# EAGLE design Sediment Board (EAGLE 7.6.0)

## Sheet 1 of 2
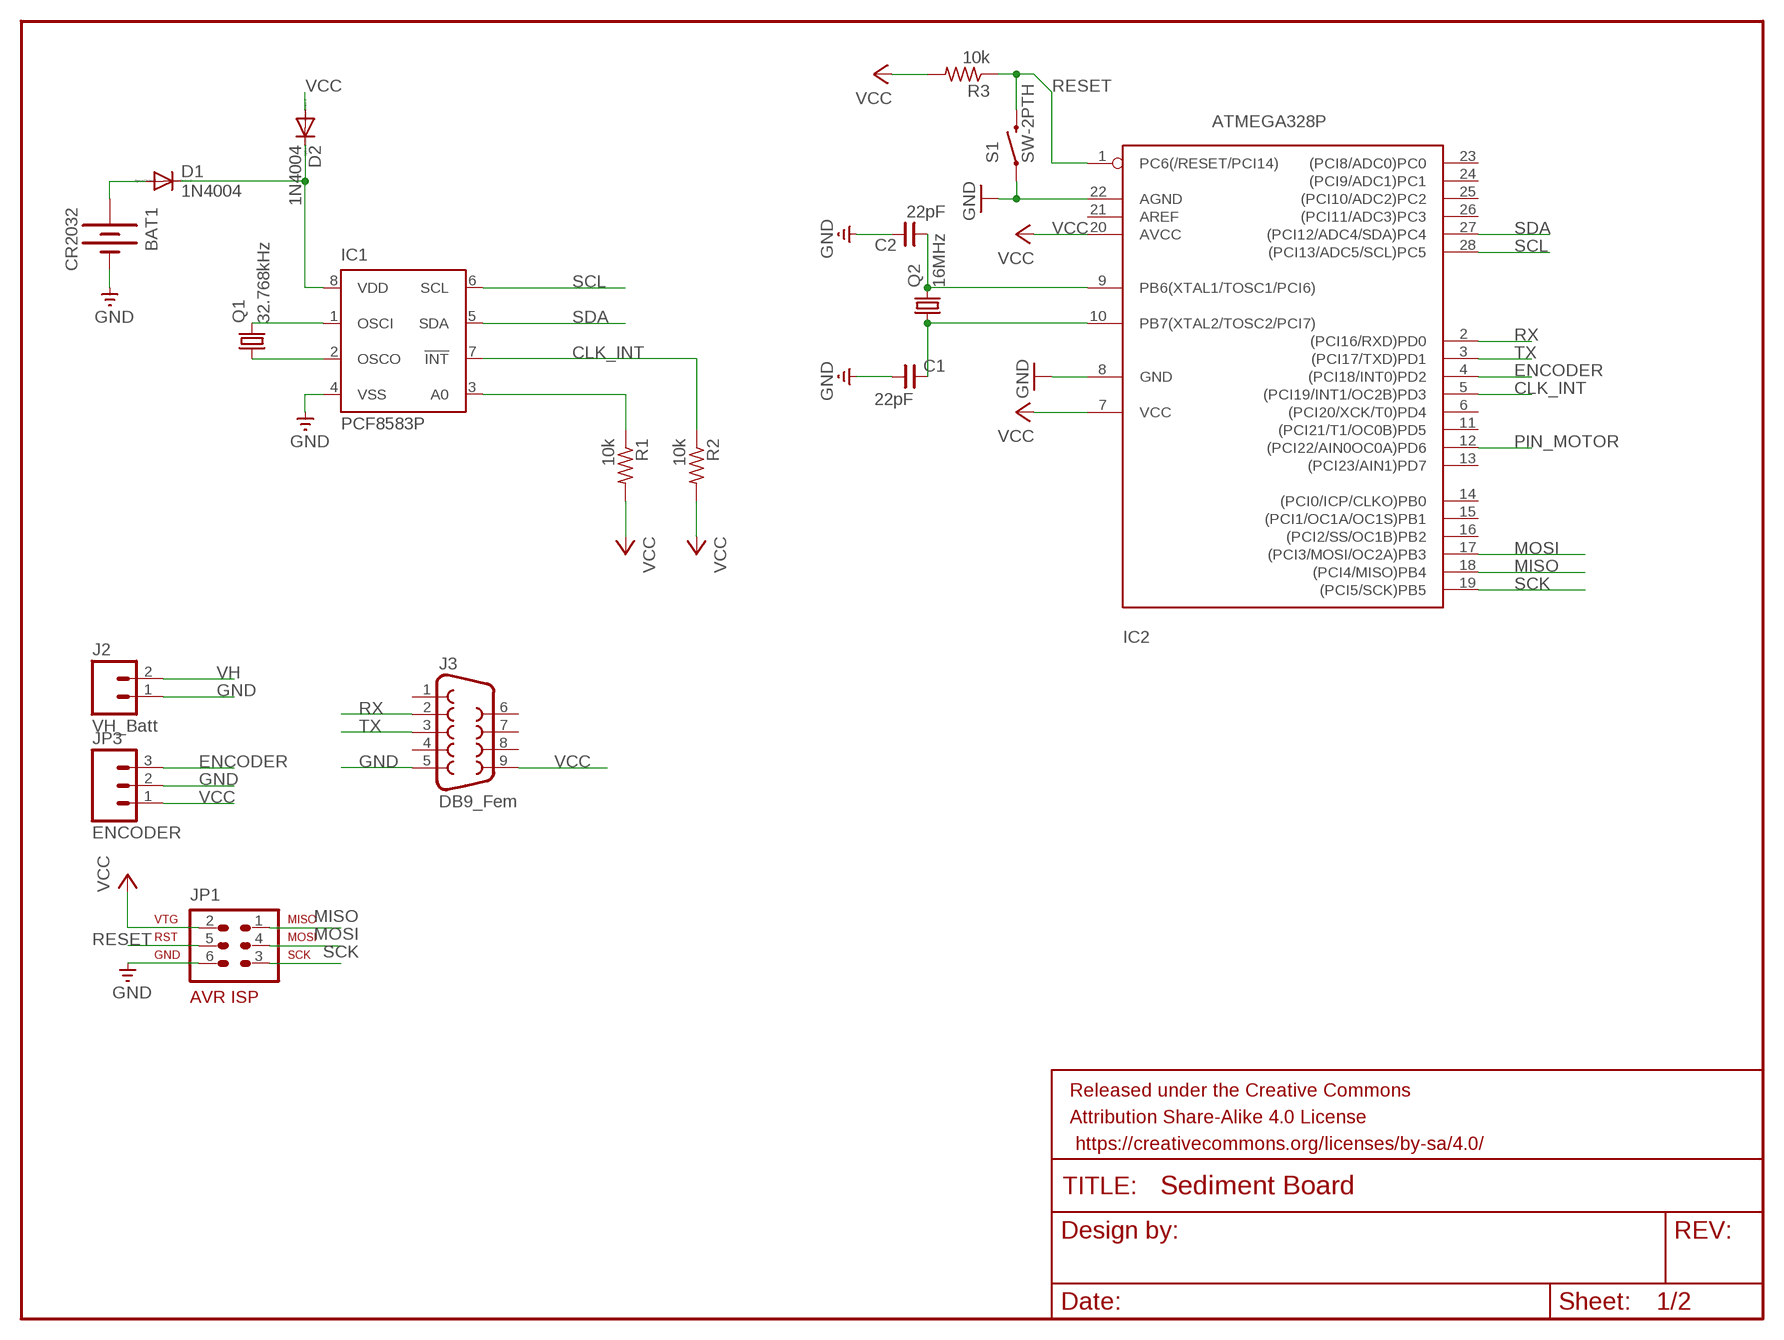
[diagram p0: schematic, sheet 1]

### Parts
BAT1  CR2032  BATTERY20PTH  [BATTCOM_20MM_PTH]
C1  22pF  CNP-C025-050X025  [C025-050X025]
C2  22pF  CNP-C025-050X025  [C025-050X025]
D1  1N4004  [DO41-10]
D2  1N4004  [DO41-10]
FRAME1  FRAME-LETTER  [CREATIVE_COMMONS]
IC1  PCF8583P  [DIL08]
IC2  ATMEGA328P  ATMEGA328PROUND  [DIL28-3-ROUND]
J2  VH_Batt  M023.5MM  [SCREWTERMINAL-3.5MM-2]
J3  DB9_Fem  DB9FEMALE  [DB9]
JP1  AVR-ISP-6  [AVR-ISP-6]
JP3  ENCODER  M03POLAR  [MOLEX-1X3]
Q1  32.768kHz  CRYSTALTC26H  [TC26H]
Q2  16MHz  CRYSTALHC49U70  [HC49U70]
R1  10k  R-US_0207/10  [0207/10]
R2  10k  R-US_0207/10  [0207/10]
R3  10k  R-US_0207/10  [0207/10]
S1  SW-2PTH  SWITCH-MOMENTARY-2PTH  [TACTILE-PTH]

### Nets
CLK_INT: IC1.7(!INT) IC2.5((PCI19/INT1/OC2B)PD3) R2.1
ENCODER: IC2.4((PCI18/INT0)PD2) JP3.3
GND: BAT1.2(-) C1.1 C2.2 IC1.4(VSS) IC2.8(GND) IC2.22(AGND) J2.1 J3.5 JP1.6 JP3.2 S1.1 ; also sheet 2
MISO: IC2.18((PCI4/MISO)PB4) JP1.1
MOSI: IC2.17((PCI3/MOSI/OC2A)PB3) JP1.4
N$1: D1.C D2.C IC1.8(VDD)
N$2: IC1.1(OSCI) Q1.2
N$3: IC1.2(OSCO) Q1.1
N$5: BAT1.1(+) D1.A
N$6: IC1.3(A0) R1.1
N$7: C2.1 IC2.9(PB6(XTAL1/TOSC1/PCI6)) Q2.2
N$8: C1.2 IC2.10(PB7(XTAL2/TOSC2/PCI7)) Q2.1
PIN_MOTOR: IC2.12((PCI22/AIN0OC0A)PD6) ; also sheet 2
RESET: IC2.1(PC6(/RESET/PCI14)) JP1.5 R3.1 S1.3
RX: IC2.2((PCI16/RXD)PD0) J3.2
SCK: IC2.19((PCI5/SCK)PB5) JP1.3
SCL: IC1.6(SCL) IC2.28((PCI13/ADC5/SCL)PC5)
SDA: IC1.5(SDA) IC2.27((PCI12/ADC4/SDA)PC4)
TX: IC2.3((PCI17/TXD)PD1) J3.3
VCC: D2.A IC2.7(VCC) IC2.20(AVCC) J3.9 JP1.2 JP3.1 R1.2 R2.2 R3.2 ; also sheet 2
VH: J2.2 ; also sheet 2
Unconnected: IC2.6((PCI20/XCK/T0)PD4) IC2.11((PCI21/T1/OC0B)PD5) IC2.13((PCI23/AIN1)PD7) IC2.14((PCI0/ICP/CLKO)PB0) IC2.15((PCI1/OC1A/OC1S)PB1) IC2.16((PCI2/SS/OC1B)PB2) IC2.21(AREF) IC2.23((PCI8/ADC0)PC0) IC2.24((PCI9/ADC1)PC1) IC2.25((PCI10/ADC2)PC2) IC2.26((PCI11/ADC3)PC3) J3.1 J3.4 J3.6 J3.7 J3.8

## Sheet 2 of 2
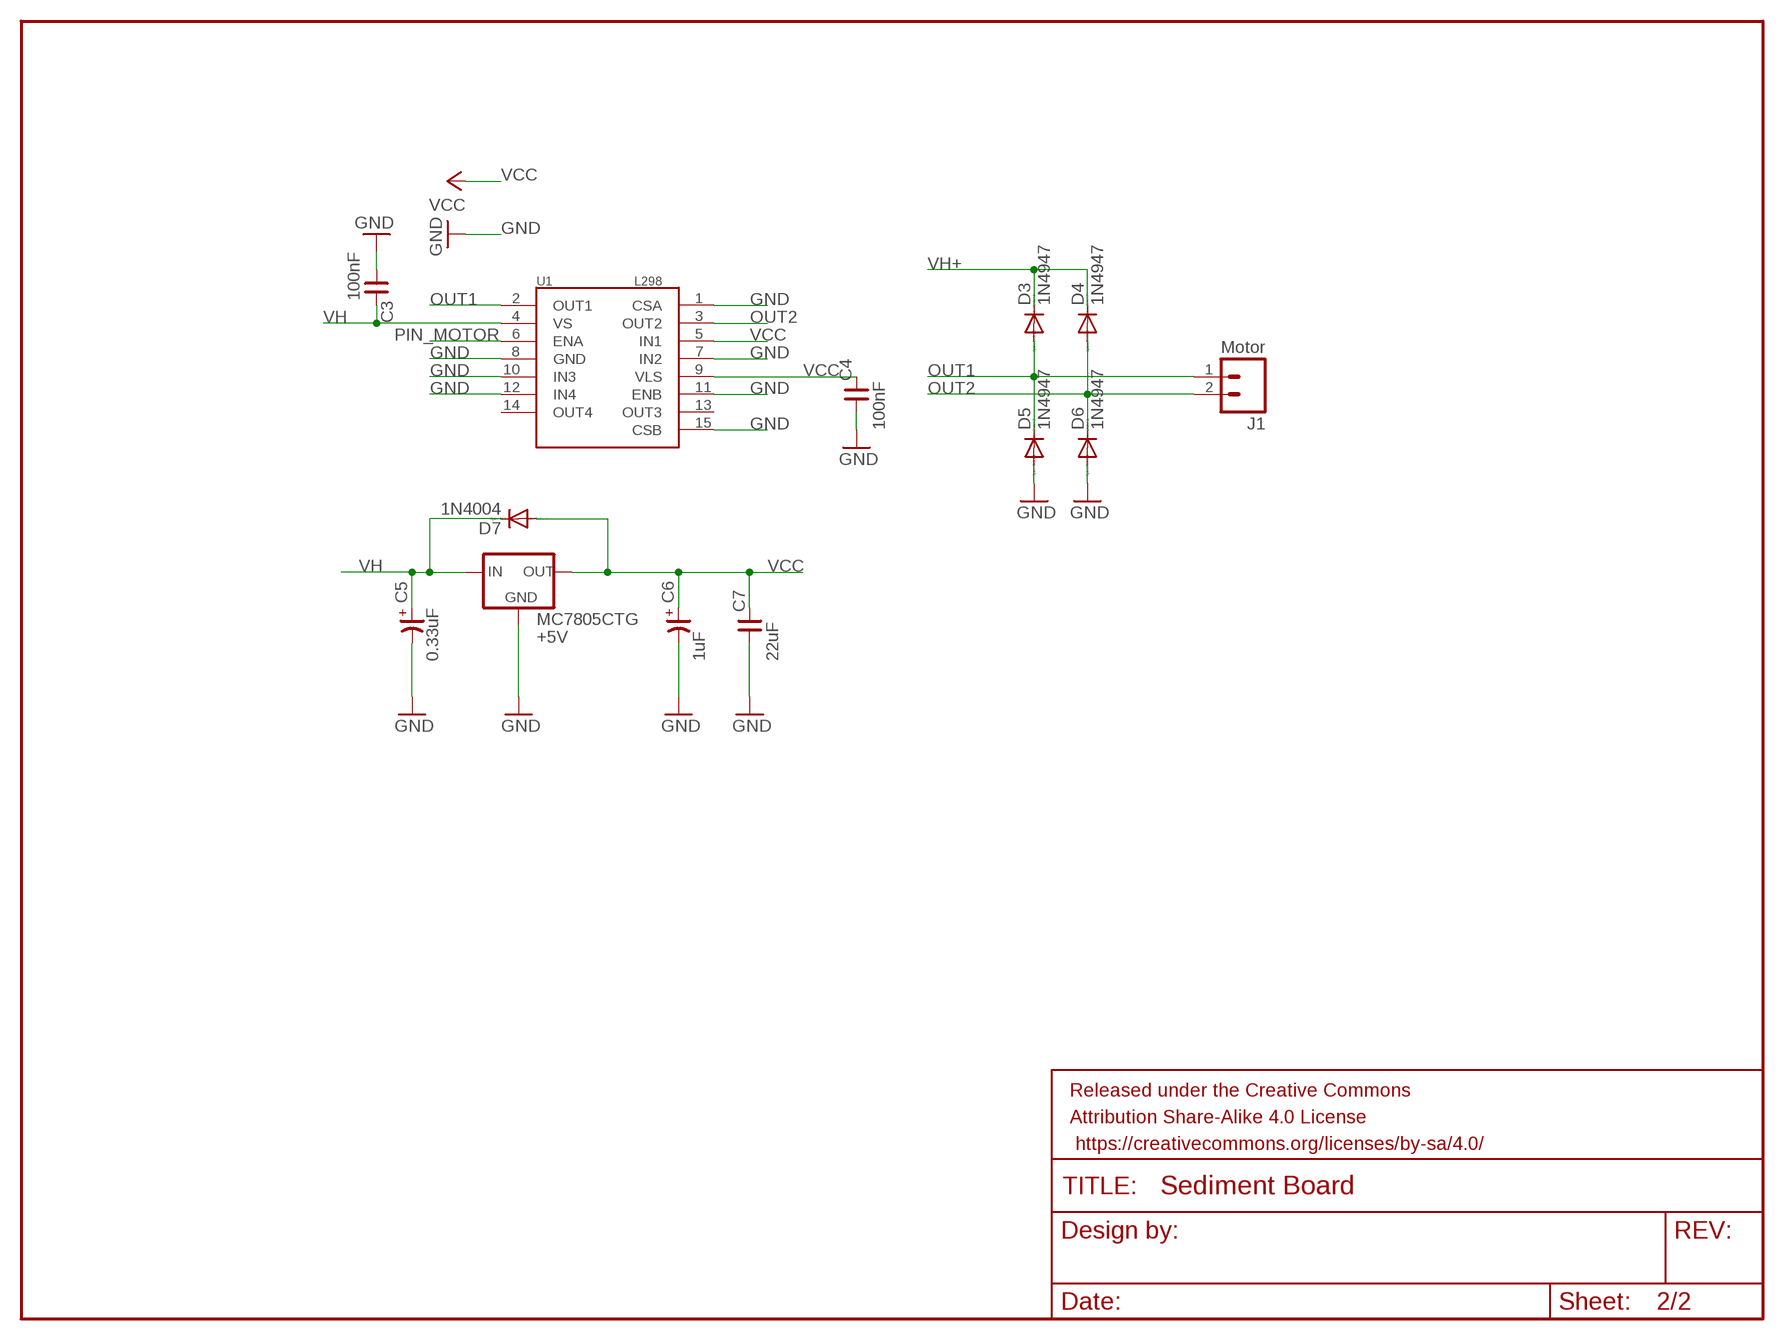
[diagram p1: schematic, sheet 2]

### Parts
C3  100nF  CNP-C025-050X025  [C025-050X025]
C4  100nF  CNP-C025-050X025  [C025-050X025]
C5  0.33uF  CP-TT025-040  [TT-025-040]
C6  1uF  CP-TT025-040  [TT-025-040]
C7  22uF  CNP-C025-050X025  [C025-050X025]
D3  1N4947  1N4942  [DO41-10]
D4  1N4947  1N4942  [DO41-10]
D5  1N4947  1N4942  [DO41-10]
D6  1N4947  1N4942  [DO41-10]
D7  1N4004  [DO41-10]
FRAME2  FRAME-LETTER  [CREATIVE_COMMONS]
J1  Motor  M023.5MM  [SCREWTERMINAL-3.5MM-2]
MC7805CTG  +5V  V_REG_78XXSIDE  [78XXL]
U1  L298  [MULTIWATT15]

### Nets
GND: C3.1 C4.1 C5.- C6.- C7.1 D5.A D6.A MC7805CTG.GND U1.1(CSA) U1.7(IN2) U1.8(GND) U1.10(IN3) U1.11(ENB) U1.12(IN4) U1.15(CSB) ; also sheet 1
OUT1: D3.A D5.C J1.1 U1.2(OUT1)
OUT2: D4.A D6.C J1.2 U1.3(OUT2)
PIN_MOTOR: U1.6(ENA) ; also sheet 1
VCC: C4.2 C6.+ C7.2 D7.A MC7805CTG.OUT U1.5(IN1) U1.9(VLS) ; also sheet 1
VH: C3.2 C5.+ D7.C MC7805CTG.IN U1.4(VS) ; also sheet 1
VH+: D3.C D4.C
Unconnected: U1.13(OUT3) U1.14(OUT4)

## Library data of the parts
BAT1 = SparkFun:BATTERY: Battery Holders Various common sizes : AA, AAA, 20mm coin cell and 12mm coin cell.
C1-C4 C7 = cap-master:CNP-: NON-POLARIZED CAP
C5 C6 = cap-master:CP-: POLARIZED CAP
D1 D2 D7 = diode:1N4004: DIODE general purpose rectifier, 1 A
D3-D6 = diode:1N4942: DIODE 1.0 A, 200 V, 150 ns
FRAME1 FRAME2 = SparkFun-Aesthetics:FRAME-LETTER: Schematic Frame Standard 8.5x11 US Letter frame
IC1 = ds1307_pcf8583:PCF8583: I2C-Bus CLOCK/CALENDAR
IC2 = atmega328:ATMEGA328*P: MICROCONTROLLER 32 kBytes FLASH 2 kBytes SRAM 1 kBytes EEPROM USART 8-channel 10 bit ADC
J1 J2 = SparkFun-Connectors:M02: Standard 2-pin 0.1" header. Use with - straight break away headers ( PRT-00116) - right angle break away headers (PRT-00553) - swiss pins (PRT-00743) - machine pins (PRT-00117) - female headers (PRT-00115) Molex polarized connector foot print use with: PRT-08233 with associated crimp pins and housings. 2.54_SCREWTERM for use with PRT-10571. 3.5mm Screw Terminal footprints for PRT-08084 5mm Screw Terminal footprints for use with PRT-08432; PROD_ID: CONN-08399
J3 = SparkFun-Connectors:DB9: DB9 Connector Standard DB9 (D-Sub 9) serial connector. Can be used for CAN bus as well as RS485 and RS232. Footprint production proven. Spark Fun Electronics SKU : PRT-00429; PROD_ID: CONN-08194
JP1 = atmel-1:AVR-ISP-6: AVR ISP-6 Serial Programming Header
JP3 = SparkFun:M03: Header 3 Standard 3-pin 0.1" header. Use with straight break away headers (SKU : PRT-00116), right angle break away headers (PRT-00553), swiss pins (PRT-00743), machine pins (PRT-00117), and female headers (PRT-00115). Molex polarized connector foot print use with SKU : PRT-08232 with associated crimp pins and housings.
MC7805CTG = SparkFun:V_REG_78XX: Voltage Regulator Standard 7805 5V regulator. IGO (Input Ground Output). Spark Fun Electronics SKU : COM-00107
Q1 Q2 = crystal:CRYSTAL: CRYSTAL; OC_FARNELL: unknown; OC_NEWARK: unknown
R1-R3 = resistor:R-US_: RESISTOR, American symbol
S1 = SparkFun:SWITCH-MOMENTARY-2
U1 = SparkFun:L298: L298 Dual Full Bridge Driver

## Net classes
0 default: clearance 0.205 mm

## Board
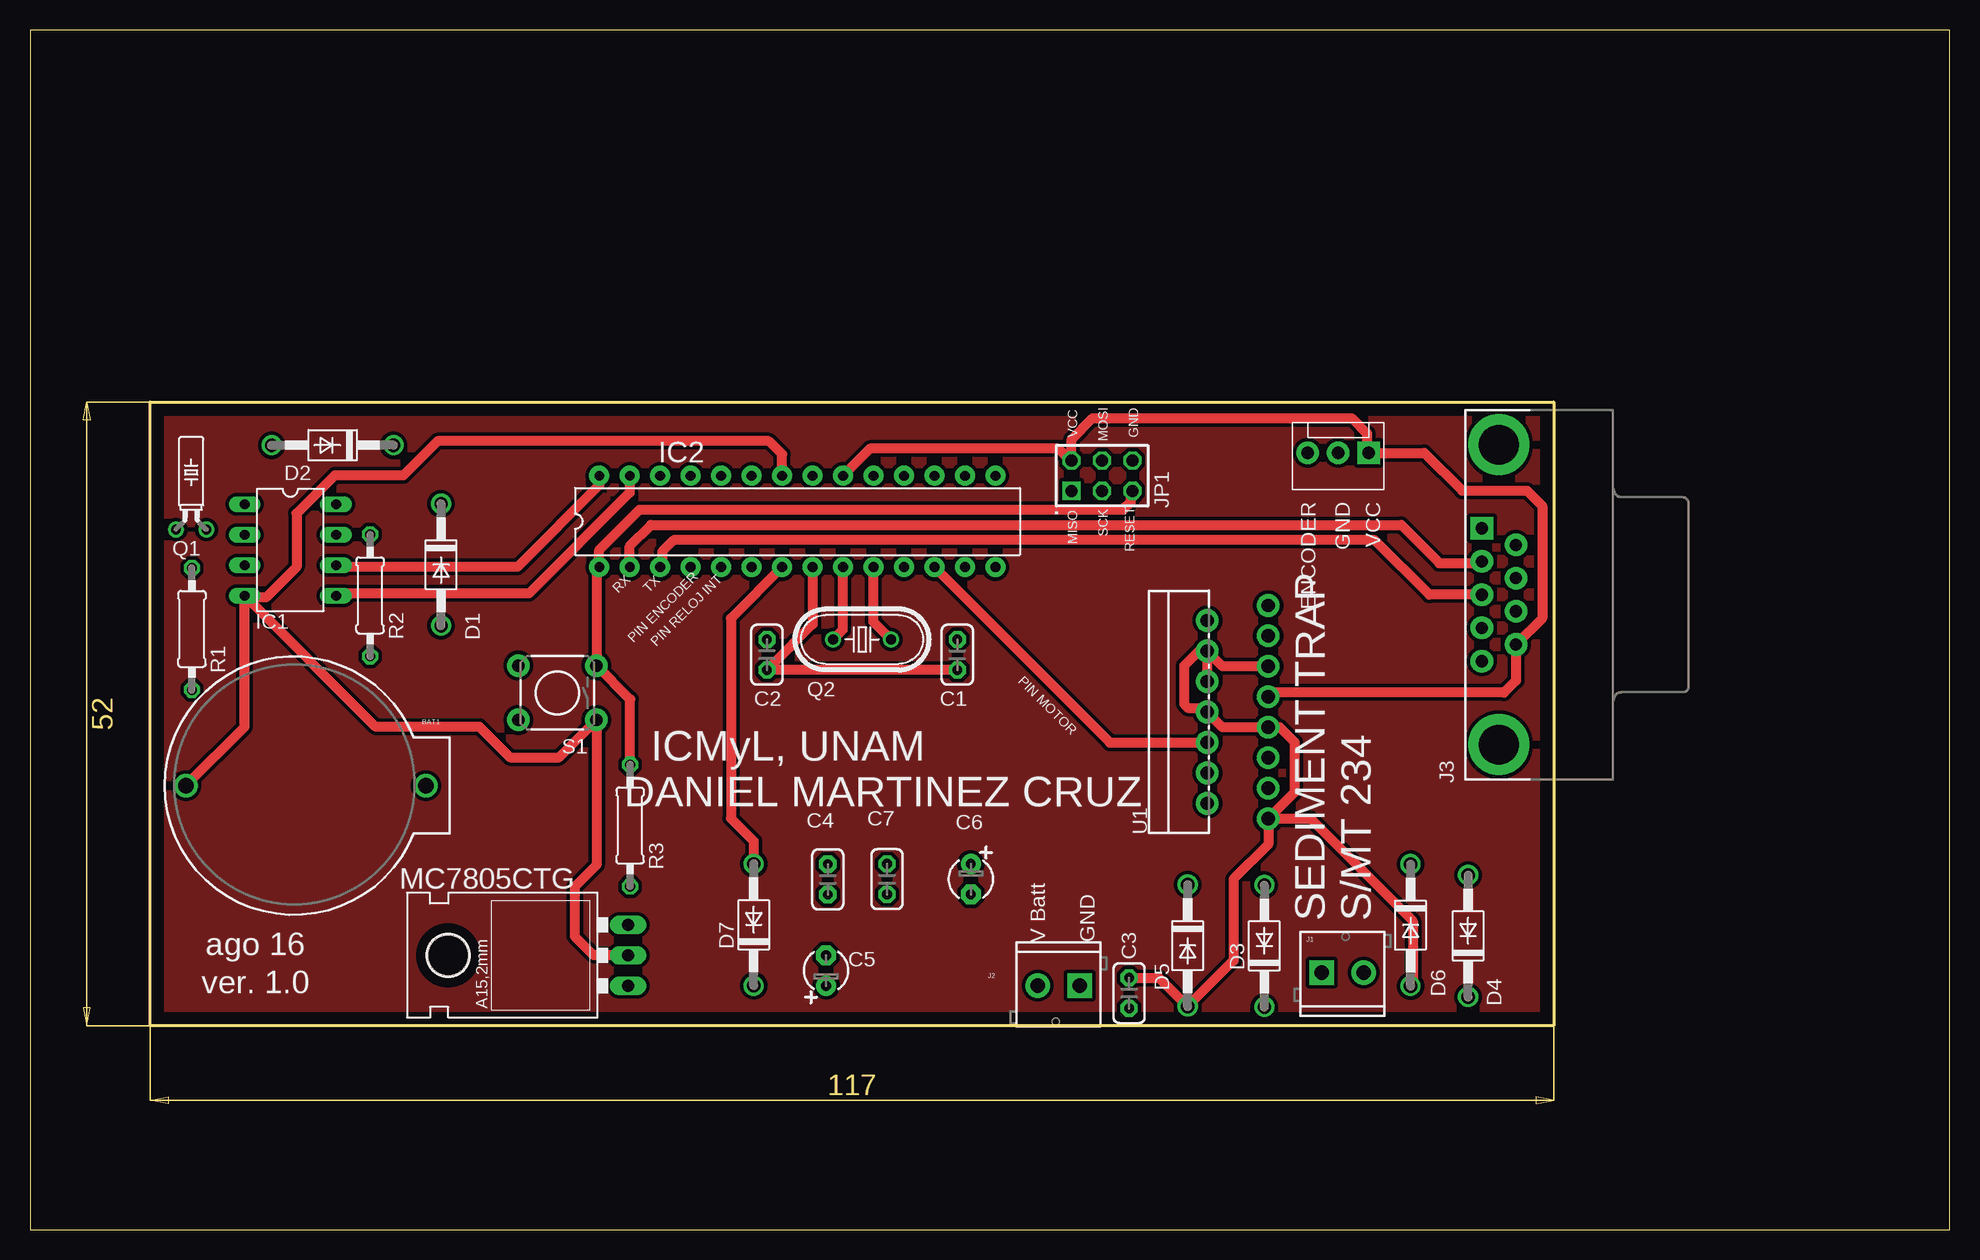
[diagram p2: board, top side]
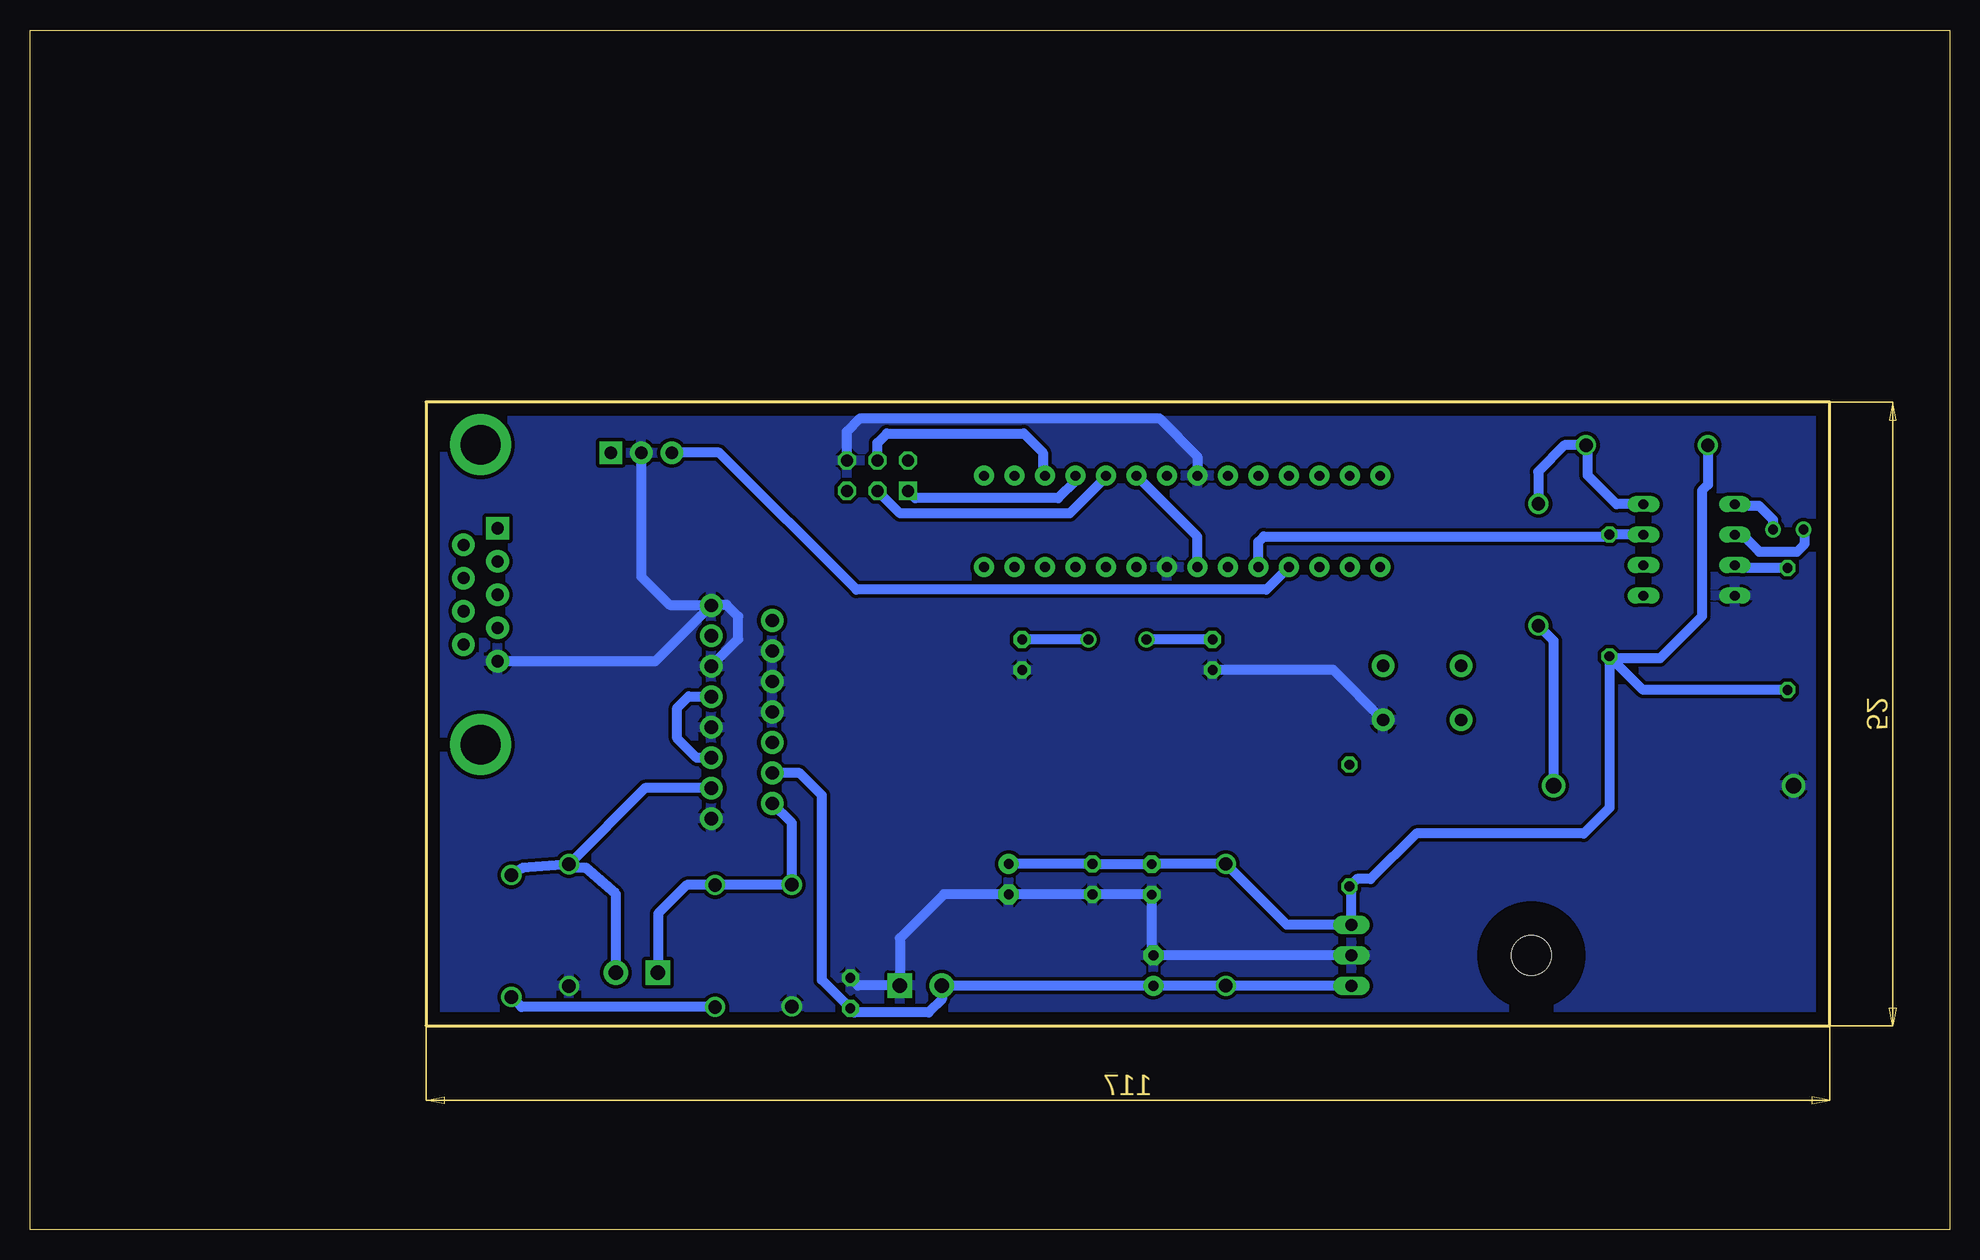
[diagram p3: board, bottom side, seen from below]

Size 160 x 100 mm. Coordinates in mm from the lower left corner, seen from the top.
Outline: 0,0 160,0 160,100 0,100 0,0
Outline: 10,69 127,69 127,17 10,17 10,69
Copper layers (1*16): Top 0.035mm / dielectric 1.5mm / Bottom 0.035mm
Design rules "default": minimum track width 10mil, minimum drill 24mil, track to track 8mil, track to pad 8mil, pad to pad 8mil, via to via 8mil, smd to smd 8mil, copper to edge 40mil, drill to drill 8mil, minimum pad ring 10mil, minimum via ring 8mil, stop-mask expansion 4mil, vias tented up to drill 0mil, thermal gap 10mil

### Footprints (pad centres in the part's own frame; a part is rotated, then mirrored left to right if it is on the bottom)
BATTCOM_20MM_PTH = drill 1.3: 1 20,0; 2 0,0
C025-050X025 = drill 0.813 pad 1.422 octagon: 1 -1.27,0; 2 1.27,0
TT-025-040 = drill 0.813 pad 1.676: + -1.27,0 | drill 0.813 pad 1.676 octagon: - 1.27,0
DO41-10 = drill 1.118: A 5.08,0; C -5.08,0
DIL08 = drill 0.813 long: 1 -3.81,-3.81; 2 -1.27,-3.81; 3 1.27,-3.81; 4 3.81,-3.81; 5 3.81,3.81; 6 1.27,3.81; 7 -1.27,3.81; 8 -3.81,3.81
DIL28-3-ROUND = drill 0.813 pad 1.676: 1 -16.51,-3.81; 2 -13.97,-3.81; 3 -11.43,-3.81; 4 -8.89,-3.81; 5 -6.35,-3.81; 6 -3.81,-3.81; 7 -1.27,-3.81; 8 1.27,-3.81; 9 3.81,-3.81; 10 6.35,-3.81; 11 8.89,-3.81; 12 11.43,-3.81; 13 13.97,-3.81; 14 16.51,-3.81; 15 16.51,3.81; 16 13.97,3.81; 17 11.43,3.81; 18 8.89,3.81; 19 6.35,3.81; 20 3.81,3.81; 21 1.27,3.81; 22 -1.27,3.81; 23 -3.81,3.81; 24 -6.35,3.81; 25 -8.89,3.81; 26 -11.43,3.81; 27 -13.97,3.81; 28 -16.51,3.81
SCREWTERMINAL-3.5MM-2 = drill 1.2 pad 2.032 square: 1 0,0 | drill 1.2 pad 2.032: 2 3.5,0
DB9 = drill 1.016 pad 1.88 square: 1 -5.54,-1.42 | drill 1.016 pad 1.88: 2 -2.77,-1.42; 3 0,-1.42; 4 2.77,-1.42; 5 5.54,-1.42; 6 -4.15,1.42; 7 -1.38,1.42; 8 1.38,1.42; 9 4.15,1.42 | drill 3.302 pad 5.08: G1 -12.5,0; G2 12.5,0
AVR-ISP-6 = drill 1.016 square: 1 -2.54,-1.27 | drill 1.016 octagon: 2 -2.54,1.27; 3 0,-1.27; 4 0,1.27; 5 2.54,-1.27; 6 2.54,1.27
MOLEX-1X3 = drill 1.016 pad 1.88 square: 1 0,0 | drill 1.016 pad 1.88: 2 2.54,0; 3 5.08,0
78XXL = drill 1.016 long: GND 0,-3.81; IN -2.54,-3.81; OUT 2.54,-3.81 | hole 3.302: 0,11.176
TC26H = drill 0.813: 1 -1.27,0; 2 1.27,0
HC49U70 = drill 0.813: 1 -2.413,0; 2 2.413,0
0207/10 = drill 0.813 octagon: 1 -5.08,0; 2 5.08,0
TACTILE-PTH = drill 1.016 pad 1.88: 1 -3.251,2.261; 2 3.251,2.261; 3 -3.251,-2.261; 4 3.251,-2.261
MULTIWATT15 = drill 1.1 pad 1.9: 1 -8.95,-2.39; 2 -7.68,2.69; 3 -6.41,-2.39; 4 -5.14,2.69; 5 -3.87,-2.39; 6 -2.6,2.69; 7 -1.33,-2.39; 8 -0.06,2.69; 9 1.21,-2.39; 10 2.48,2.69; 11 3.75,-2.39; 12 5.02,2.69; 13 6.29,-2.39; 14 7.56,2.69; 15 8.83,-2.39

### Placement (x,y rotation side)
BAT1  12.99,37.01 0 top
C1  77.3,47.92 90 top
C2  61.42,47.92 270 top
C3  91.61,19.71 270 top
C4  66.5,29.19 90 top
C5  66.36,21.59 90 top
C6  78.42,29.21 270 top
C7  71.44,29.21 90 top
D1  34.27,55.42 270 top
D2  25.23,65.38 180 top
D3  102.89,23.64 90 top
D4  119.87,24.47 90 top
D5  96.5,23.67 270 top
D6  115.08,25.38 270 top
D7  60.33,25.4 90 top
FRAME1  54.51,1.76 0 top
FRAME2  54.51,1.76 0 top
IC1  21.7,56.65 270 top
IC2  63.96,59.03 0 top
J1  107.66,21.41 0 top
J2  87.49,20.34 180 top
J3  122.44,52.92 270 top
JP1  89.36,62.84 0 top
JP3  111.58,64.75 180 top
MC7805CTG  46.04,22.86 90 top
Q1  13.44,58.35 0 top
Q2  69.36,49.19 180 top
R1  13.49,50.07 270 top
R2  28.35,52.87 270 top
R3  50.02,33.68 270 top
S1  43.96,44.74 180 top
U1  100.82,43.2 90 top

### Tracks (layer width: path | path; a pad name or v marks a point on that pad's centre or on a via)
CLK_INT
  Bottom 0.813: IC1.7 28.32,57.92 R2.1 28.51,57.78 57.15,57.78 57.61,57.33 IC2.5
ENCODER
  Bottom 0.813: IC2.4 56.95,53.34 91.12,53.34 102.55,64.77 106.48,64.77 JP3.3
GND
  Top 0.813: IC1.4 17.89,41.9 BAT1.2 | C3.1 94.11,20.98 D5.A 100.33,22.42 100.33,29.21 103.21,32.09 U1.1 | U1.11 99.4,46.95 U1.12 | U1.12 97.44,48.22 96.2,46.99 96.2,43.81 96.52,43.5 97.78,43.5 U1.8 99.4,41.87 U1.7 104.18,41.87 105.41,40.64 105.41,36.45 U1.1 | U1.10 U1.12 | IC2.8 65.23,50.46 61.84,47.07 | 61.84,47.07 C2.2 | C1.1 62.25,46.65 61.84,47.07 | U1.1 106.72,34.25 115.25,25.72 115.25,20.47 D6.A | MC7805CTG.GND 46.99,22.86 45.4,24.45 45.4,28.57 47.21,30.38 S1.1 44.09,39.37 40.01,39.37 37.47,41.9 28.83,41.9 IC1.4 | IC2.22 62.69,64.63 61.59,65.72 33.97,65.72 31.11,62.87 25.4,62.87 22.23,59.69 22.23,55.24 19.68,52.7 18.03,52.7 IC1.4
  Bottom 0.813: S1.1 51.37,46.65 C2.2 | MC7805CTG.GND C5.- 66.5,23 C4.1 66.52,27.94 C7.1 C6.- 83.82,27.94 87.49,24.27 J2.1 90.98,20.34 C3.1 | JP1.6 91.9,66.53 90.81,67.63 65.86,67.63 62.69,64.45 IC2.22 | JP3.2 109.05,54.44 106.68,52.07 103.25,52.07 U1.15 | J3.5 107.86,47.38 U1.15 | U1.11 103.21,46.97 100.97,49.21 100.97,51.12 101.92,52.07 103.17,52.07 U1.15
  pour Bottom (isolate 0.305): 10.16,68.9 127,68.9 127,17.14 10.16,17.14
MISO
  Bottom 0.813: IC2.18 72.85,62.41 74.3,60.96 86.21,60.96 JP1.1
MOSI
  Bottom 0.813: JP1.4 89.36,65.58 88.58,66.36 77.15,66.36 75.56,64.77 75.56,63.02 IC2.17
N$1
  Bottom 0.813: D2.C 30.8,65.38 | 30.8,65.38 32.09,65.38 34.29,63.18 34.29,60.52 D1.C | IC1.8 27.76,60.46 30.16,62.87 30.16,64.75 30.8,65.38
N$2
  Bottom 0.813: Q1.2 14.71,59.16 15.88,60.33 17.76,60.33 IC1.1
N$3
  Bottom 0.813: IC1.2 17.28,57.92 15.88,56.52 12.7,56.52 12.06,57.15 12.06,58.26 Q1.1
N$4
  pour Top (isolate 0.305): 9.84,68.9 127,68.9 127,16.83 9.84,16.83
N$5
  Bottom 0.813: BAT1.1 32.99,49.07 D1.A
N$6
  Bottom 0.813: R1.1 17.66,55.15 IC1.3
N$7
  Top 0.813: Q2.2 67.77,50.02 IC2.9
  Bottom 0.813: C2.1 Q2.2
N$8
  Top 0.813: Q2.1 70.31,50.65 IC2.10
  Bottom 0.813: Q2.1 C1.2
OUT1
  Bottom 0.813: J1.1 107.63,21.44 107.63,26.35 105.27,28.72 D3.A 102.86,28.75 D5.C 96.5,33.89 U1.2
OUT2
  Bottom 0.813: 115.06,30.12 D6.C | D6.C 118.97,30.14 D4.A | J1.2 111.16,27.97 113.67,30.16 115.06,30.16 D6.C | U1.3 108.74,36.79 D6.C
PIN_MOTOR
  Top 0.813: IC2.12 90.01,40.6 U1.6
RESET
  Top 0.813: JP1.5 91.76,61.43 91.76,60.64 91.12,60.01 50.8,60.01 47.45,56.66 IC2.1 47.21,54.98 S1.3 50.02,44.19 R3.1
RX
  Top 0.813: IC2.2 49.99,56.98 51.75,58.74 114.3,58.74 117.47,55.56 120.89,55.56 J3.2
SCK
  Bottom 0.813: IC2.19 70.31,62.72 73.34,59.69 87.48,59.69 JP1.3
SCL
  Top 0.813: IC2.28 47.45,62.05 40.64,55.24 25.65,55.24 IC1.6
SDA
  Top 0.813: IC2.27 49.99,61.42 41.59,53.02 25.7,53.02 IC1.5
TX
  Top 0.813: J3.3 116.62,52.92 112.08,57.47 53.66,57.47 52.7,56.52 52.7,55.4 IC2.3
VCC
  Top 0.813: IC2.7 58.42,50.95 58.42,34.29 60.33,32.38 D7.A | U1.9 103.57,44.77 122.87,44.77 123.86,45.76 J3.9 126.05,50.95 126.05,60.33 124.78,61.59 119.38,61.59 116.23,64.75 JP3.1 111.44,64.89 111.44,66.36 110.17,67.63 88.58,67.63 86.82,65.86 JP1.2 86.7,64.11 85.72,65.09 70.02,65.09 IC2.20
  Bottom 0.813: C6.+ C7.2 71.42,30.46 C4.2 66.48,30.48 D7.A 55.24,25.4 MC7805CTG.OUT 49.85,28.42 R3.2 49.41,29.21 48.26,29.21 44.45,33.02 30.48,33.02 28.35,35.15 R2.2 | U1.5 104.42,39.33 106.05,40.96 106.05,43.5 105.09,44.45 103.25,44.45 U1.9 | D2.A 20.14,62.09 20.64,61.59 20.64,51.12 24.13,47.62 28.19,47.62 R2.2 | IC2.7 62.69,57.76 IC2.20 | R1.2 25.55,44.99 R2.2
VH
  Bottom 0.813: MC7805CTG.IN D7.C C5.+ 83.97,20.32 J2.2 83.99,19.2 85.09,18.1 91.28,18.1 C3.2 93.98,20.8 93.98,36.2 95.85,38.06 U1.4
VH+
  Bottom 0.813: D3.C 119.04,18.56 D4.C

### Text on the board
tPlace: VCC | MOSI | GND | ENCODER | GND | VCC | . | SCK | MISO | RESET | RX | TX | PIN ENCODER | PIN RELOJ INT | ICMyL, UNAM | PIN MOTOR | DANIEL MARTINEZ CRUZ | V Batt | GND | SEDIMENT TRAP / S/MT 234 | ago 16 | ver. 1.0